# EAGLE design wii (EAGLE 8.0.0)
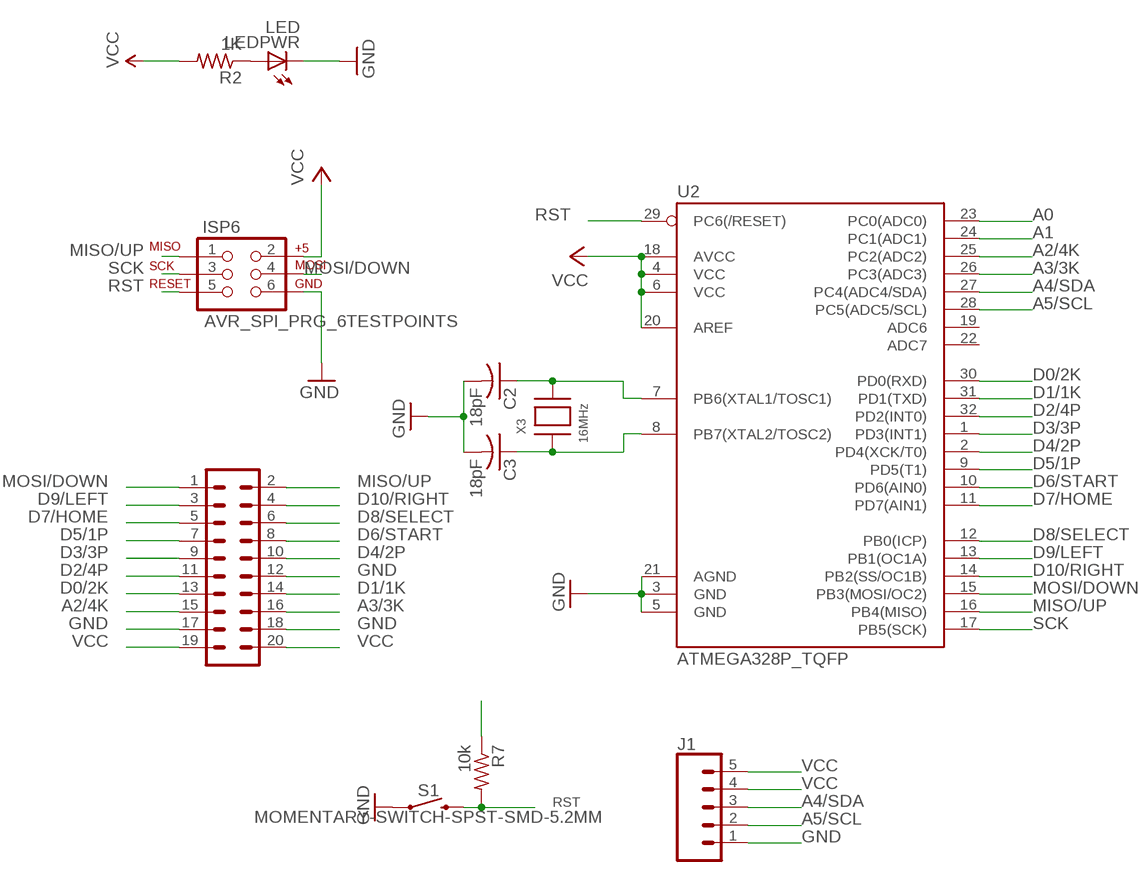
[diagram p0: schematic, sheet 1]

## Parts
C2  18pF  C-USC0805  [C0805]
C3  18pF  C-USC0805  [C0805]
ISP6  AVR_SPI_PRG_6TESTPOINTS  [2X3_TEST_POINTS]
J1  CONN_05  [1X05]
LEDPWR  LED  LEDCHIPLED_0805  [CHIPLED_0805]
R2  1K  R-US_R0805  [R0805]
R7  10k  R-US_R0805  [R0805]
S1  MOMENTARY-SWITCH-SPST-SMD-5.2MM  [TACTILE_SWITCH_SMD_5.2MM]
U2  ATMEGA328P_TQFP  [TQFP32-08]
U$1  20 pin breakout  M10X2ROUND_NOSILK  [2X10_ROUND_NOSILK]
X3  16MHz  XTALNX5032  [NX5032]

## Nets
A0: U2.23(PC0(ADC0))
A1: U2.24(PC1(ADC1))
A2/4K: U2.25(PC2(ADC2)) U$1.15
A3/3K: U2.26(PC3(ADC3)) U$1.16
A4/SDA: J1.3 U2.27(PC4(ADC4/SDA))
A5/SCL: J1.2 U2.28(PC5(ADC5/SCL))
D0/2K: U2.30(PD0(RXD)) U$1.13
D1/1K: U2.31(PD1(TXD)) U$1.14
D2/4P: U2.32(PD2(INT0)) U$1.11
D3/3P: U2.1(PD3(INT1)) U$1.9
D4/2P: U2.2(PD4(XCK/T0)) U$1.10
D5/1P: U2.9(PD5(T1)) U$1.7
D6/START: U2.10(PD6(AIN0)) U$1.8
D7/HOME: U2.11(PD7(AIN1)) U$1.5
D8/SELECT: U2.12(PB0(ICP)) U$1.6
D9/LEFT: U2.13(PB1(OC1A)) U$1.3
D10/RIGHT: U2.14(PB2(SS/OC1B)) U$1.4
GND: C2.2 C3.2 ISP6.6 J1.1 LEDPWR.C S1.1 U2.3(GND) U2.5(GND) U2.21(AGND) U$1.12 U$1.17 U$1.18
MISO/UP: ISP6.1 U2.16(PB4(MISO)) U$1.2
MOSI/DOWN: ISP6.4 U2.15(PB3(MOSI/OC2)) U$1.1
N$2: LEDPWR.A R2.1
N$8: C2.1 U2.7(PB6(XTAL1/TOSC1)) X3.P$2
N$9: C3.1 U2.8(PB7(XTAL2/TOSC2)) X3.P$1
RST: ISP6.5 R7.2 S1.3 U2.29(PC6(/RESET))
SCK: ISP6.3 U2.17(PB5(SCK))
VCC: ISP6.2 J1.4 J1.5 R2.2 R7.1 U2.4(VCC) U2.6(VCC) U2.18(AVCC) U2.20(AREF) U$1.19 U$1.20
Unconnected: U2.19(ADC6) U2.22(ADC7)

## Library data of the parts
C2 C3 = adafruit:C-US: CAPACITOR, American symbol
ISP6 = SparkFun-Connectors:AVR_SPI_PRG_6: AVR ISP 6 Pin This is the reduced ISP connector for AVR programming. Common on Arduino. This footprint will take up less PCB space and can be used with a 10-pin to 6-pin adapter such as SKU: BOB-08508 **Special note about "TEST_POINT" package. The stop mask is on the top side, so if you want your programming test points to be on the bottom of your board, make sure to place this package on the bottom side of the board. This also ensure that the orientation to program from the bottom side will be correct.
J1 = SparkFun-Connectors:CONN_05: Multi connection point. Often used as Generic Header-pin footprint for 0.1 inch spaced/style header connections On any of the 0.1 inch spaced packages, you can populate with these: Break Away Headers - Straight <https://www.sparkfun.com/products/116> (PRT-00116) Break Away Male Headers - Right Angle <https://www.sparkfun.com/products/553> (PRT-00553) Female Headers <https://www.sparkfun.com/products/115> (PRT-00115) Break Away Headers - Machine Pin <https://www.sparkfun.com/products/117> (PRT-00117) Break Away Female Headers - Swiss Machine Pin <https://www.sparkfun.com/products/743> (PRT-00743) For SCREWTERMINALS and SPRING TERMINALS visit here: Screw Terimnals on SparkFun.com <https://www.sparkfun.com/search/results?term=Screw+Terminals> (5mm/3.5mm/2.54mm spacing) This device is also useful as a general connection point to wire up your design to another part of your project. Our various solder wires solder well into these plated through hole pads. Hook-Up Wire - Assortment (Stranded, 22 AWG) <https://www.sparkfun.com/products/11375> (PRT-11375) Hook-Up Wire - Assortment (Solid Core, 22 AWG) <https://www.sparkfun.com/products/11367> (PRT-11367) View the entire wire category on our website here <https://www.sparkfun.com/categories/141> Special notes: Molex polarized connector foot print use with SKU : PRT-08231 with associated crimp pins and housings. 1MM SMD Version SKU: PRT-10208
LEDPWR = adafruit:LED: LED OSRAM: - CHIPLED LG R971, LG N971, LY N971, LG Q971, LY Q971, LO R971, LY R971 LH N974, LH R974 LS Q976, LO Q976, LY Q976 LO Q996 - Hyper CHIPLED LW Q18S LB Q993, LB Q99A, LB R99A - SideLED LS A670, LO A670, LY A670, LG A670, LP A670 LB A673, LV A673, LT A673, LW A673 LH A674 LY A675 LS A676, LA A676, LO A676, LY A676, LW A676 LS A679, LY A679, LG A679 - Hyper Micro SIDELED® LS Y876, LA Y876, LO Y876, LY Y876 LT Y87S - SmartLED LW L88C, LW L88S LB L89C, LB L89S, LG L890 LS L89K, LO L89K, LY L89K LS L896, LA L896, LO L896, LY L896 - TOPLED LS T670, LO T670, LY T670, LG T670, LP T670 LSG T670, LSP T670, LSY T670, LOP T670, LYG T670 LG T671, LOG T671, LSG T671 LB T673, LV T673, LT T673, LW T673 LH T674 LS T676, LA T676, LO T676, LY T676, LB T676, LH T676, LSB T676, LW T676 LB T67C, LV T67C, LT T67C, LS T67K, LO T67K, LY T67K, LW E67C LS E67B, LA E67B, LO E67B, LY E67B, LB E67C, LV E67C, LT E67C LW T67C LS T679, LY T679, LG T679 LS T770, LO T770, LY T770, LG T770, LP T770 LB T773, LV T773, LT T773, LW T773 LH T774 LS E675, LA E675, LY E675, LS T675 LS T776, LA T776, LO T776, LY T776, LB T776 LHGB T686 LT T68C, LB T68C - Hyper Mini TOPLED® LB M676 - Mini TOPLED Santana® LG M470 LS M47K, LO M47K, LY M47K Source: http://www.osram.convergy.de/
R2 R7 = adafruit:R-US_: RESISTOR, American symbol
S1 = SparkFun-Switches:MOMENTARY-SWITCH-SPST: Momentary Switch (Pushbutton) - SPST Normally-open (NO) SPST momentary switches (buttons, pushbuttons). Variants PTH-12MM - 12mm square, through-hole Momentary Pushbutton Switch - 12mm Square <https://www.sparkfun.com/products/9190> (COM-09190) PTH-6.0MM, PTH-6.0MM-KIT - 6.0mm square, through-hole Mini Pushbutton Switch <https://www.sparkfun.com/products/97> (COM-00097) KIT package intended for soldering kit's - only one side of pads' copper is exposed. PTH-RIGHT-ANGLE-KIT - Right-angle, through-hole Right Angle Tactile Button <https://www.sparkfun.com/products/10791> - Used on SparkFun BigTime Watch Kit <https://www.sparkfun.com/products/11734> SMD-12MM - 12mm square, surface-mount Tactile Button - SMD (12mm) <https://www.sparkfun.com/products/12993> (COM-12993) Used on SparkFun PicoBoard <https://www.sparkfun.com/products/11888> SMD-4.5MM - 4.5mm Square Trackball Switch Used on SparkFun Blackberry Trackballer Breakout <https://www.sparkfun.com/products/13169> SMD-4.6MMX2.8MM - 4.60mm x 2.80mm, surface mount Used on SparkFun SAMD21 Mini Breakout <https://www.sparkfun.com/products/13664> SMD-5.2MM, SMD-5.2-REDUNDANT - 5.2mm square, surface-mount Mini Pushbutton Switch - SMD <https://www.sparkfun.com/products/8720> (COM-08720) Used on Arduino Pro Mini <https://www.sparkfun.com/products/11114> REDUNDANT package connects both switch circuits together SMD-6.0X3.5MM - 6.0 x 3.5mm, surface mount Momentary Reset Switch SMD <https://www.sparkfun.com/products/8229> (COM-08229) SMD-6.2MM-TALL - 6.2mm square, surface mount Tactile Button - SMD (6mm) <https://www.sparkfun.com/products/12992> Used on SparkFun Digital Sandbox <https://www.sparkfun.com/products/12651> SMD-RIGHT-ANGLE - Right-angle, surface mount Used on SparkFun Block for Intel® Edison - Arduino <https://www.sparkfun.com/products/13036>; PROD_ID: SWCH-08247; SF_SKU: COM-08720
U2 = SparkFun-IC-Microcontroller:ATMEGA328P_TQFP: Popular 328P in QFP Storefront component: ATmega328 - TQFP <https://www.sparkfun.com/products/13448> (COM-13448) Datasheet <http://www.sparkfun.com/datasheets/Components/SMD/ATMega328.pdf> SparkFun Products SparkFun RedBoard - Programmed with Arduino <https://www.sparkfun.com/products/12757> (DEV-12757) Arduino Pro Mini 328 - 5V/16MHz <https://www.sparkfun.com/products/11113> (DEV-11113) Arduino Pro Mini 328 - 3.3V/8MHz <https://www.sparkfun.com/products/11114> (DEV-11114) SparkFun OpenLog <https://www.sparkfun.com/products/13712> (DEV-13712) SparkFun MicroView - OLED Arduino Module <https://www.sparkfun.com/products/12923> (DEV-12923) SparkFun Digital Sandbox <https://www.sparkfun.com/products/12651> (DEV-12651) SparkFun PicoBoard <https://www.sparkfun.com/products/11888> (WIG-11888) Arduino Fio <https://www.sparkfun.com/products/10116> (DEV-10116) LilyPad Arduino 328 Main Board <https://www.sparkfun.com/products/13342> (DEV-13342) SparkFun RedStick <https://www.sparkfun.com/products/13741> (DEV-13741) LilyPad MP3 <https://www.sparkfun.com/products/11013> (DEV-11013) LilyPad Arduino SimpleSnap <https://www.sparkfun.com/products/10941> (DEV-10941) SparkFun Stepoko <https://www.sparkfun.com/products/13899> (ROB-13899) SparkFun Geiger Counter <https://www.sparkfun.com/products/11345> (SEN-11345) SparkFun EL Sequencer <https://www.sparkfun.com/products/12781> (COM-12781) Arduino Pro 328 - 5V/16MHz <https://www.sparkfun.com/products/10915> (DEV-10915) CryptoCape <https://www.sparkfun.com/products/12773> (DEV-12773) SparkFun IR Thermometer Evaluation Board - MLX90614 <https://www.sparkfun.com/products/10740> (SEN-10740) SparkFun RedBot Mainboard <https://www.sparkfun.com/products/12097> (ROB-12097) Arduino Pro 328 - 3.3V/8MHz <https://www.sparkfun.com/products/10914> (DEV-10914) SparkFun Block for Intel® Edison - Arduino <https://www.sparkfun.com/products/13036> (DEV-13036) SparkFun Simon Says - Surface Mount Soldering Kit <https://www.sparkfun.com/products/10935> (KIT-10935) SparkFun 7-Segment Serial Display - Red <https://www.sparkfun.com/products/11441> (COM-11441) SparkFun 7-Segment Serial Display - White <https://www.sparkfun.com/products/11629> (COM-11629) SparkFun 7-Segment Serial Display - Yellow <https://www.sparkfun.com/products/11443> (COM-11443) SparkFun 7-Segment Serial Display - Kelly Green <https://www.sparkfun.com/products/11440> (COM-11440) SparkFun 7-Segment Serial Display - Blue <https://www.sparkfun.com/products/11442> (COM-11442) SparkFun OpenSegment Serial Display - 20mm (Blue) <https://www.sparkfun.com/products/11647> (COM-11647) SparkFun OpenSegment Serial Display - 20mm (Green) <https://www.sparkfun.com/products/11646> (COM-11646) SparkFun OpenSegment Serial Display - 20mm (White) <https://www.sparkfun.com/products/11648> (COM-11648) SparkFun OpenSegment Serial Display - 20mm (Red) <https://www.sparkfun.com/products/11644> (COM-11644) SparkFun OpenSegment Serial Display - 20mm (Yellow) <https://www.sparkfun.com/products/11645> (COM-11645) SparkFun OpenSegment Shield <https://www.sparkfun.com/products/13190> (DEV-13190); PROD_ID: IC-09069
U$1 = SparkFun-Connectors:M10X2: This was SPECIALLY designed to be used with our Graphic LCD Backpack. Be sure you want to use this! It is not only staggered on each line of header holes, but IT IS ALSO offset of the center point of the top and bottom lines by 5 mil. This causes the headers to lock into place on the "standard" footprint on the LCD screen. The extra squares on the tdocu layer are there simply to reference other pins (if you were to actually populate a longer header than ten long - this is what we do with the backpacks).
X3 = adaprog:XTAL

## Board
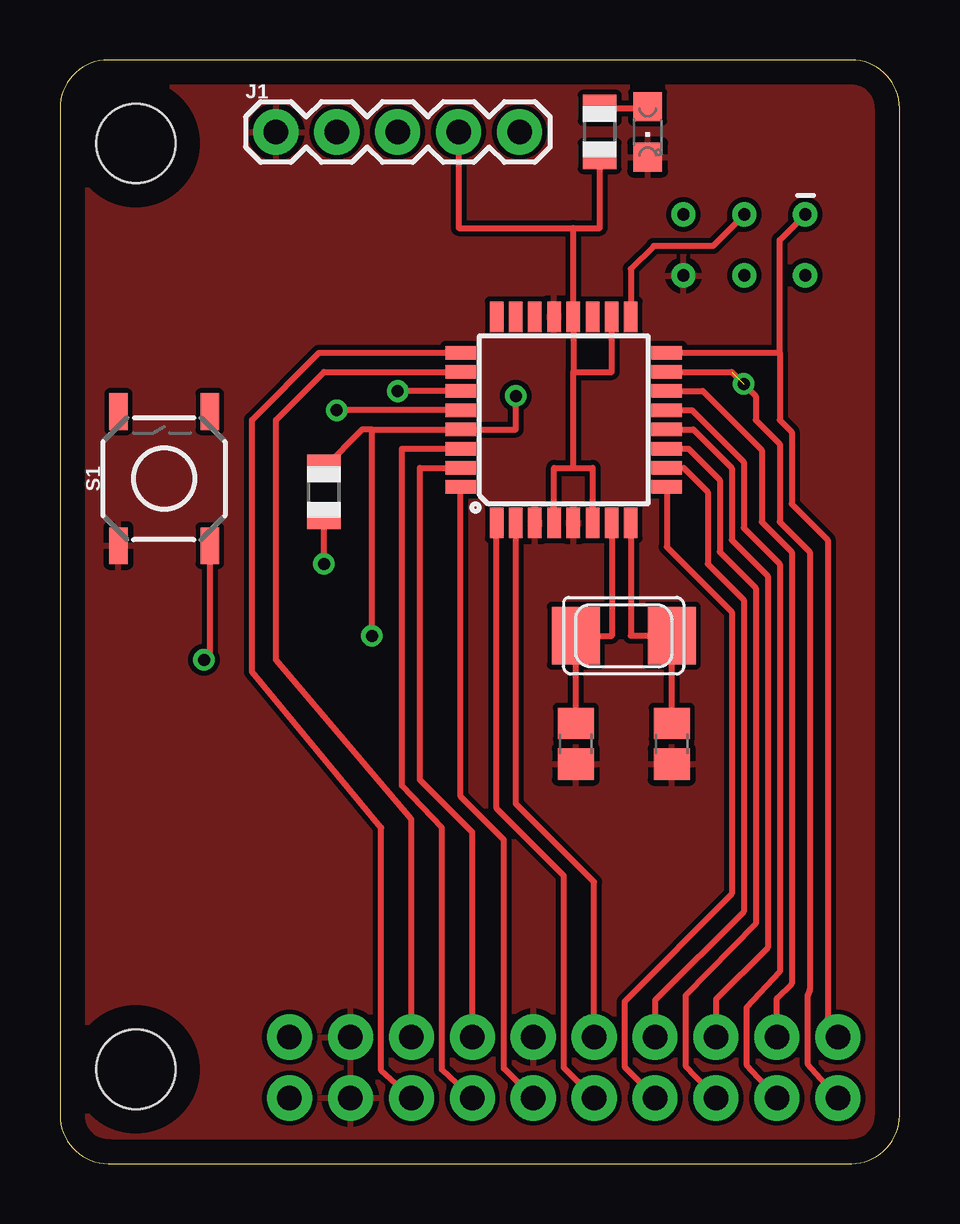
[diagram p1: board, top side]
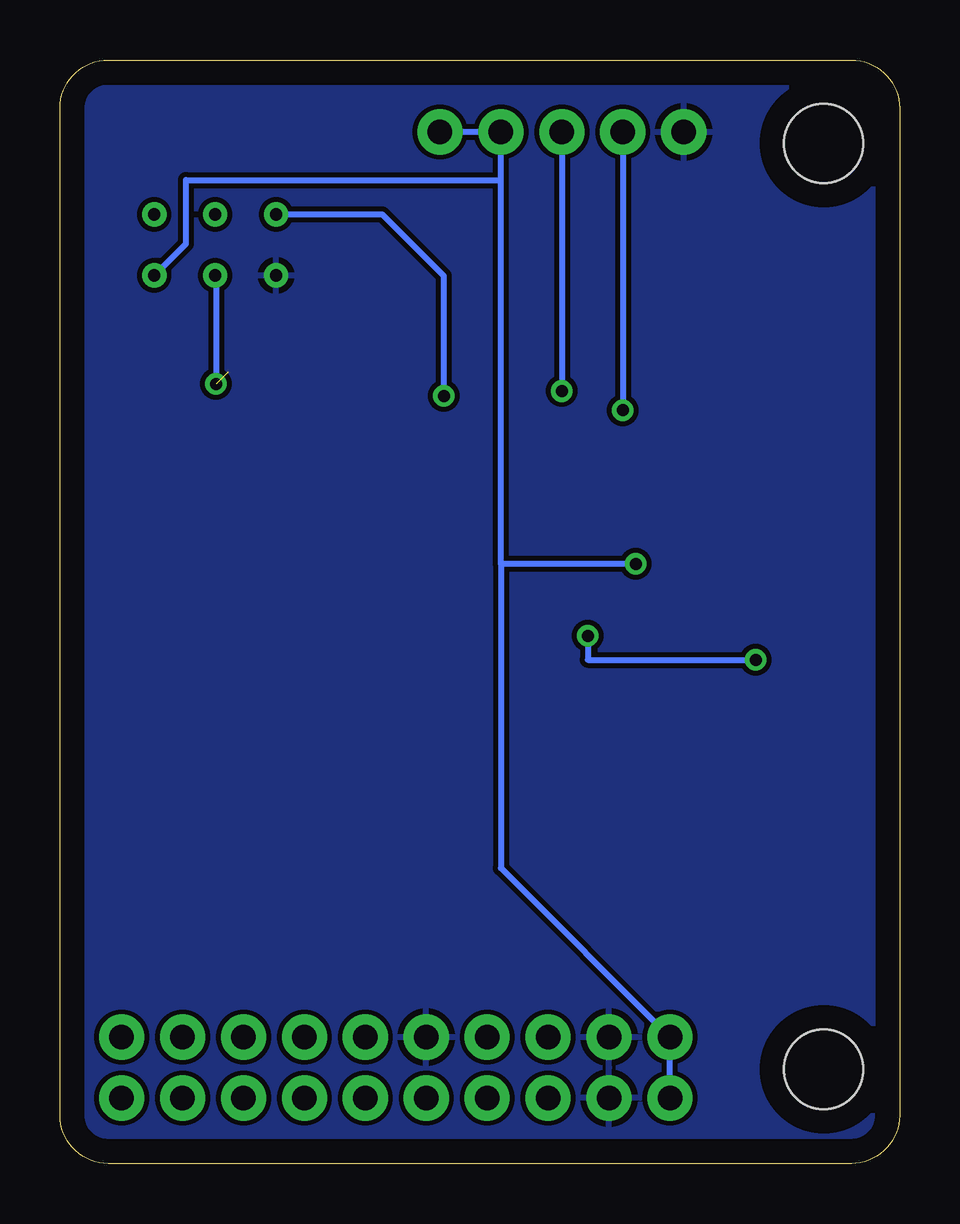
[diagram p2: board, bottom side, seen from below]

Size 35 x 46 mm. Coordinates in mm from the lower left corner, seen from the top.
Outline: 0,44 0,2 arc90 2,0 33,0 arc90 35,2 35,44 arc90 33,46 2,46 arc90 0,44
Copper layers (1*16): Top 0.035mm / dielectric 1.5mm / Bottom 0.035mm
Design rules "default": minimum track width 10mil, minimum drill 24mil, track to track 8mil, track to pad 8mil, pad to pad 8mil, via to via 8mil, smd to smd 8mil, copper to edge 40mil, drill to drill 8mil, minimum pad ring 10mil, minimum via ring 8mil, stop-mask expansion 4mil, vias tented up to drill 0mil, thermal gap 10mil

### Footprints (pad centres in the part's own frame; a part is rotated, then mirrored left to right if it is on the bottom)
C0805 = smd 1.3 x 1.5: 1 -0.85,0; 2 0.85,0
2X3_TEST_POINTS = drill 0.508: 1 -2.54,-1.27; 2 -2.54,1.27; 3 0,-1.27; 4 0,1.27; 5 2.54,-1.27; 6 2.54,1.27
1X05 = drill 1.016 pad 1.88: 1 0,0; 2 2.54,0; 3 5.08,0; 4 7.62,0; 5 10.16,0
CHIPLED_0805 = smd 1.2 x 1.2: A 0,-1.05; C 0,1.05
R0805 = smd 1.1 x 1.4: 1 -1,0; 2 1,0
TACTILE_SWITCH_SMD_5.2MM = smd 1.524 x 0.762: 1 -2.794,1.905; 2 2.794,1.905; 3 -2.794,-1.905; 4 2.794,-1.905
TQFP32-08 = smd 1.27 x 0.559: 1 -4.293,2.8; 2 -4.293,2; 3 -4.293,1.2; 4 -4.293,0.4; 5 -4.293,-0.4; 6 -4.293,-1.2; 7 -4.293,-2; 8 -4.293,-2.8; 17 4.293,-2.8; 18 4.293,-2; 19 4.293,-1.2; 20 4.293,-0.4; 21 4.293,0.4; 22 4.293,1.2; 23 4.293,2; 24 4.293,2.8 | smd 0.559 x 1.27: 9 -2.8,-4.293; 10 -2,-4.293; 11 -1.2,-4.293; 12 -0.4,-4.293; 13 0.4,-4.293; 14 1.2,-4.293; 15 2,-4.293; 16 2.8,-4.293; 25 2.8,4.293; 26 2,4.293; 27 1.2,4.293; 28 0.4,4.293; 29 -0.4,4.293; 30 -1.2,4.293; 31 -2,4.293; 32 -2.8,4.293
2X10_ROUND_NOSILK = drill 1.016 pad 1.88: 1 -11.43,-1.27; 2 -11.43,1.27; 3 -8.89,-1.27; 4 -8.89,1.27; 5 -6.35,-1.27; 6 -6.35,1.27; 7 -3.81,-1.27; 8 -3.81,1.27; 9 -1.27,-1.27; 10 -1.27,1.27; 11 1.27,-1.27; 12 1.27,1.27; 13 3.81,-1.27; 14 3.81,1.27; 15 6.35,-1.27; 16 6.35,1.27; 17 8.89,-1.27; 18 8.89,1.27; 19 11.43,-1.27; 20 11.43,1.27
STAND-OFF = hole 3.302: 0,0
NX5032 = smd 2 x 2.4: P$1 2,0; P$2 -2,0

### Placement (x,y rotation side)
C2  21.5,17.5 270 top
C3  25.5,17.5 270 top
ISP6  28.53,38.29 180 top
J1  9,43 0 top
LEDPWR  24.5,43 180 top
R2  22.5,43 270 top
R7  11,28 90 top
S1  4.34,28.55 90 top
U2  21,31 90 top
U$1  21,4 0 bottom
U$2  [STAND-OFF]  3.16,42.52 0 top
U$3  [STAND-OFF]  3.16,3.92 0 top
X3  23.5,22 0 top

### Tracks (layer width: path | path; a pad name or v marks a point on that pad's centre or on a via)
A2/4K
  Top 0.254: U$1.15 13.39,3.88 13.39,14 8,20.5 8,31 10.8,33.8 U2.25
A3/3K
  Top 0.254: U$1.16 14.65,14.35 9,21 9,31 11,33 U2.26
A4/SDA  (via drill 0.5)
  Top 0.254: U2.27 v14.08,32.2
  Bottom 0.254: J1.3 v14.08,32.2
A5/SCL  (via drill 0.5)
  Top 0.254: U2.28 v11.54,31.4
  Bottom 0.254: J1.2 v11.54,31.4
D0/2K
  Top 0.254: U$1.13 15.92,3.92 15.92,14 14.25,15.75 14.25,29.8 U2.30
D1/1K
  Top 0.254: U$1.14 17.19,13.81 15,16 15,29 U2.31
D2/4P
  Top 0.254: U$1.11 18.5,3.96 18.5,13.5 16.71,15.29 U2.32
D3/3P
  Top 0.254: U$1.9 21,4 21,12 18.2,14.8 U2.1
D4/2P
  Top 0.254: U$1.10 22.27,11.73 19,15 U2.2
D5/1P
  Top 0.254: U2.9 25.29,25.71 28,23 28,11.25 23.54,6.75 23.54,4.04 U$1.7
D6/START
  Top 0.254: U2.10 26,29 27,28 27,25 28.5,23.5 28.5,10.5 24.81,6.81 U$1.8
D7/HOME
  Top 0.254: U2.11 26.2,29.8 27.5,28.5 27.5,25.5 29,24 29,10 26.08,7 26.08,4.08 U$1.5
D8/SELECT
  Top 0.254: U2.12 26.4,30.6 28,29 28,26 29.5,24.5 29.5,9 27.35,6.85 U$1.6
D9/LEFT
  Top 0.254: U2.13 26.35,31.4 28.5,29.25 28.5,26.5 30,25 30,8 28.62,6.5 28.62,4.12 U$1.3
D10/RIGHT
  Top 0.254: U2.14 26.8,32.2 29.25,29.75 29.25,26.75 30.5,25.5 30.5,7.5 29.89,6.89 U$1.4
GND
  pour Bottom: 0,46 35,46 35,0 0,0
  pour Top: 0,46 35,46 35,0 0,0
MISO/UP
  Top 0.254: U$1.2 32,5.7 32,26 30.5,27.5 30.5,30.5 30,31 30,33.8 | ISP6.1 30,38.49 30,33.8 | U2.16 30,33.8
MOSI/DOWN  (via drill 0.5)  (1 unrouted)
  Top 0.254: U2.15 28,33 29,32 29,31 30,30 30,26.75 31.25,25.5 31.25,7.25 31.16,7 31.16,4.16 U$1.1
  Bottom 0.254: ISP6.4 28.5,36.99 v28.5,32.5
N$2
  Top 0.254: R2.1 24.5,44 LEDPWR.A
N$8
  Top 0.254: U2.7 23,22 X3.P$2 C2.1
N$9
  Top 0.254: U2.8 23.8,22 X3.P$1 C3.1
RST  (via drill 0.5)
  Top 0.254: R7.2 12.6,30.6 13,30.6 | 13,30.6 U2.29 19,30.6 v19,32 | S1.3 6.25,21 v6,21 | v13,22 13,30.6
  Bottom 0.254: v19,32 19,37 21.56,39.56 ISP6.5 | v13,22 13,21 v6,21
SCK
  Top 0.254: ISP6.3 27.22,38.25 24.75,38.25 23.8,37.3 U2.17
VCC  (via drill 0.5)
  Top 0.254: 21.4,29 21.4,33 | 21.4,33 U2.20 21.4,39 | U2.6 22.2,29 21.4,29 | U2.4 20.6,29 21.4,29 | 21.4,33 23,33 U2.18 | J1.4 16.62,39 21.4,39 | 21.4,39 22.5,39 R2.2 | v11,25 R7.1
  Bottom 0.254: ISP6.2 29.75,38.34 29.75,41 16.62,41 | 16.62,41 J1.4 J1.5 | U$1.19 U$1.20 16.62,12.32 16.62,25 | 16.62,25 16.62,41 | v11,25 16.62,25